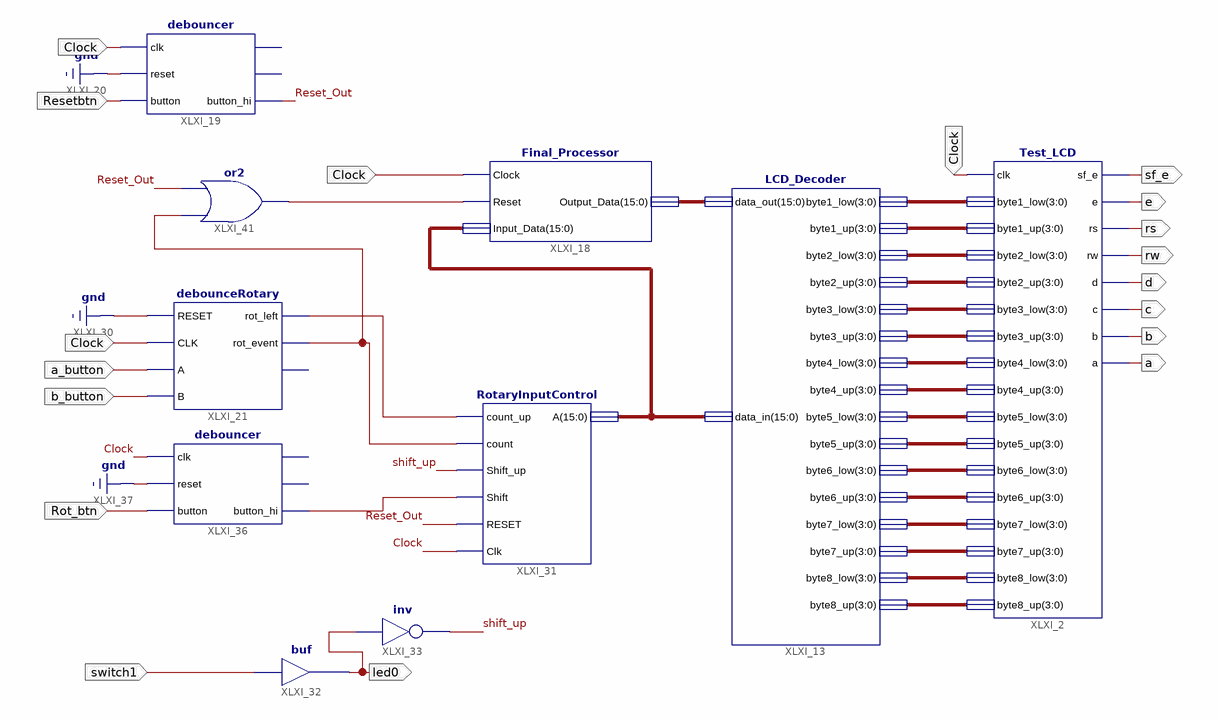
[diagram p0: schematic sheet 1]
// Xilinx ISE schematic IO_Processor.sch (spartan3e) as structural Verilog: 10 symbols, 15 ports
module IO_Processor (
  input  Clock,
  input  Resetbtn,
  input  a_button,
  input  b_button,
  input  switch1,
  input  Rot_btn,
  output sf_e,
  output e,
  output rs,
  output rw,
  output d,
  output c,
  output b,
  output a,
  output led0
);

  wire Reset_Out, shift_up, XLXN_96, XLXN_108, XLXN_121, XLXN_122;
  wire [3:0] XLXN_25, XLXN_26, XLXN_27, XLXN_28, XLXN_29, XLXN_30, XLXN_31, XLXN_32, XLXN_40, XLXN_41,
       XLXN_42, XLXN_43, XLXN_44, XLXN_45, XLXN_46, XLXN_47;
  wire [15:0] Input, XLXN_24;

  Test_LCD XLXI_2 (
    .clk(Clock), .byte1_low(XLXN_25), .byte1_up(XLXN_26), .byte2_low(XLXN_27), .byte2_up(XLXN_28),
    .byte3_low(XLXN_29), .byte3_up(XLXN_30), .byte4_low(XLXN_31), .byte4_up(XLXN_32), .sf_e(sf_e), .e(e),
    .rs(rs), .rw(rw), .d(d), .c(c), .b(b), .a(a), .byte5_low(XLXN_40), .byte5_up(XLXN_41),
    .byte6_low(XLXN_42), .byte6_up(XLXN_43), .byte7_low(XLXN_44), .byte7_up(XLXN_45), .byte8_low(XLXN_46),
    .byte8_up(XLXN_47));
  LCD_Decoder XLXI_13 (
    .data_out(XLXN_24), .data_in(Input), .byte1_low(XLXN_25), .byte1_up(XLXN_26), .byte2_low(XLXN_27),
    .byte2_up(XLXN_28), .byte3_low(XLXN_29), .byte3_up(XLXN_30), .byte4_low(XLXN_31), .byte4_up(XLXN_32),
    .byte5_low(XLXN_40), .byte5_up(XLXN_41), .byte6_low(XLXN_42), .byte6_up(XLXN_43), .byte7_low(XLXN_44),
    .byte7_up(XLXN_45), .byte8_low(XLXN_46), .byte8_up(XLXN_47));
  Final_Processor XLXI_18 (.Clock(Clock), .Reset(XLXN_108), .Input_Data(Input), .Output_Data(XLXN_24));
  debouncer XLXI_19 (.clk(Clock), .reset(1'b0), .button(Resetbtn), .button_hi(Reset_Out));  // open: debutton, button_lo
  debounceRotary XLXI_21 (
    .CLK(Clock), .RESET(1'b0), .A(a_button), .B(b_button), .rot_event(XLXN_122), .rot_left(XLXN_121));  // open: rot_event_delay
  RotaryInputControl XLXI_31 (
    .count_up(XLXN_121), .count(XLXN_122), .Shift_up(shift_up), .Shift(XLXN_96), .RESET(Reset_Out),
    .Clk(Clock), .A(Input));
  not XLXI_33 (shift_up, led0);
  buf XLXI_32 (led0, switch1);
  debouncer XLXI_36 (.clk(Clock), .reset(1'b0), .button(Rot_btn), .button_hi(XLXN_96));  // open: debutton, button_lo
  or XLXI_41 (XLXN_108, XLXN_122, Reset_Out);
endmodule
